# EAGLE schematic Arduelli (EAGLE 6.5.0)
Arduelli: Board that connects the ELL-i stack to the Arduino world (so that Arduino based shields work seamlessly with Ell-i)
CREVISION: 0.1; DESIGNER: Kameswar Rao Vaddina
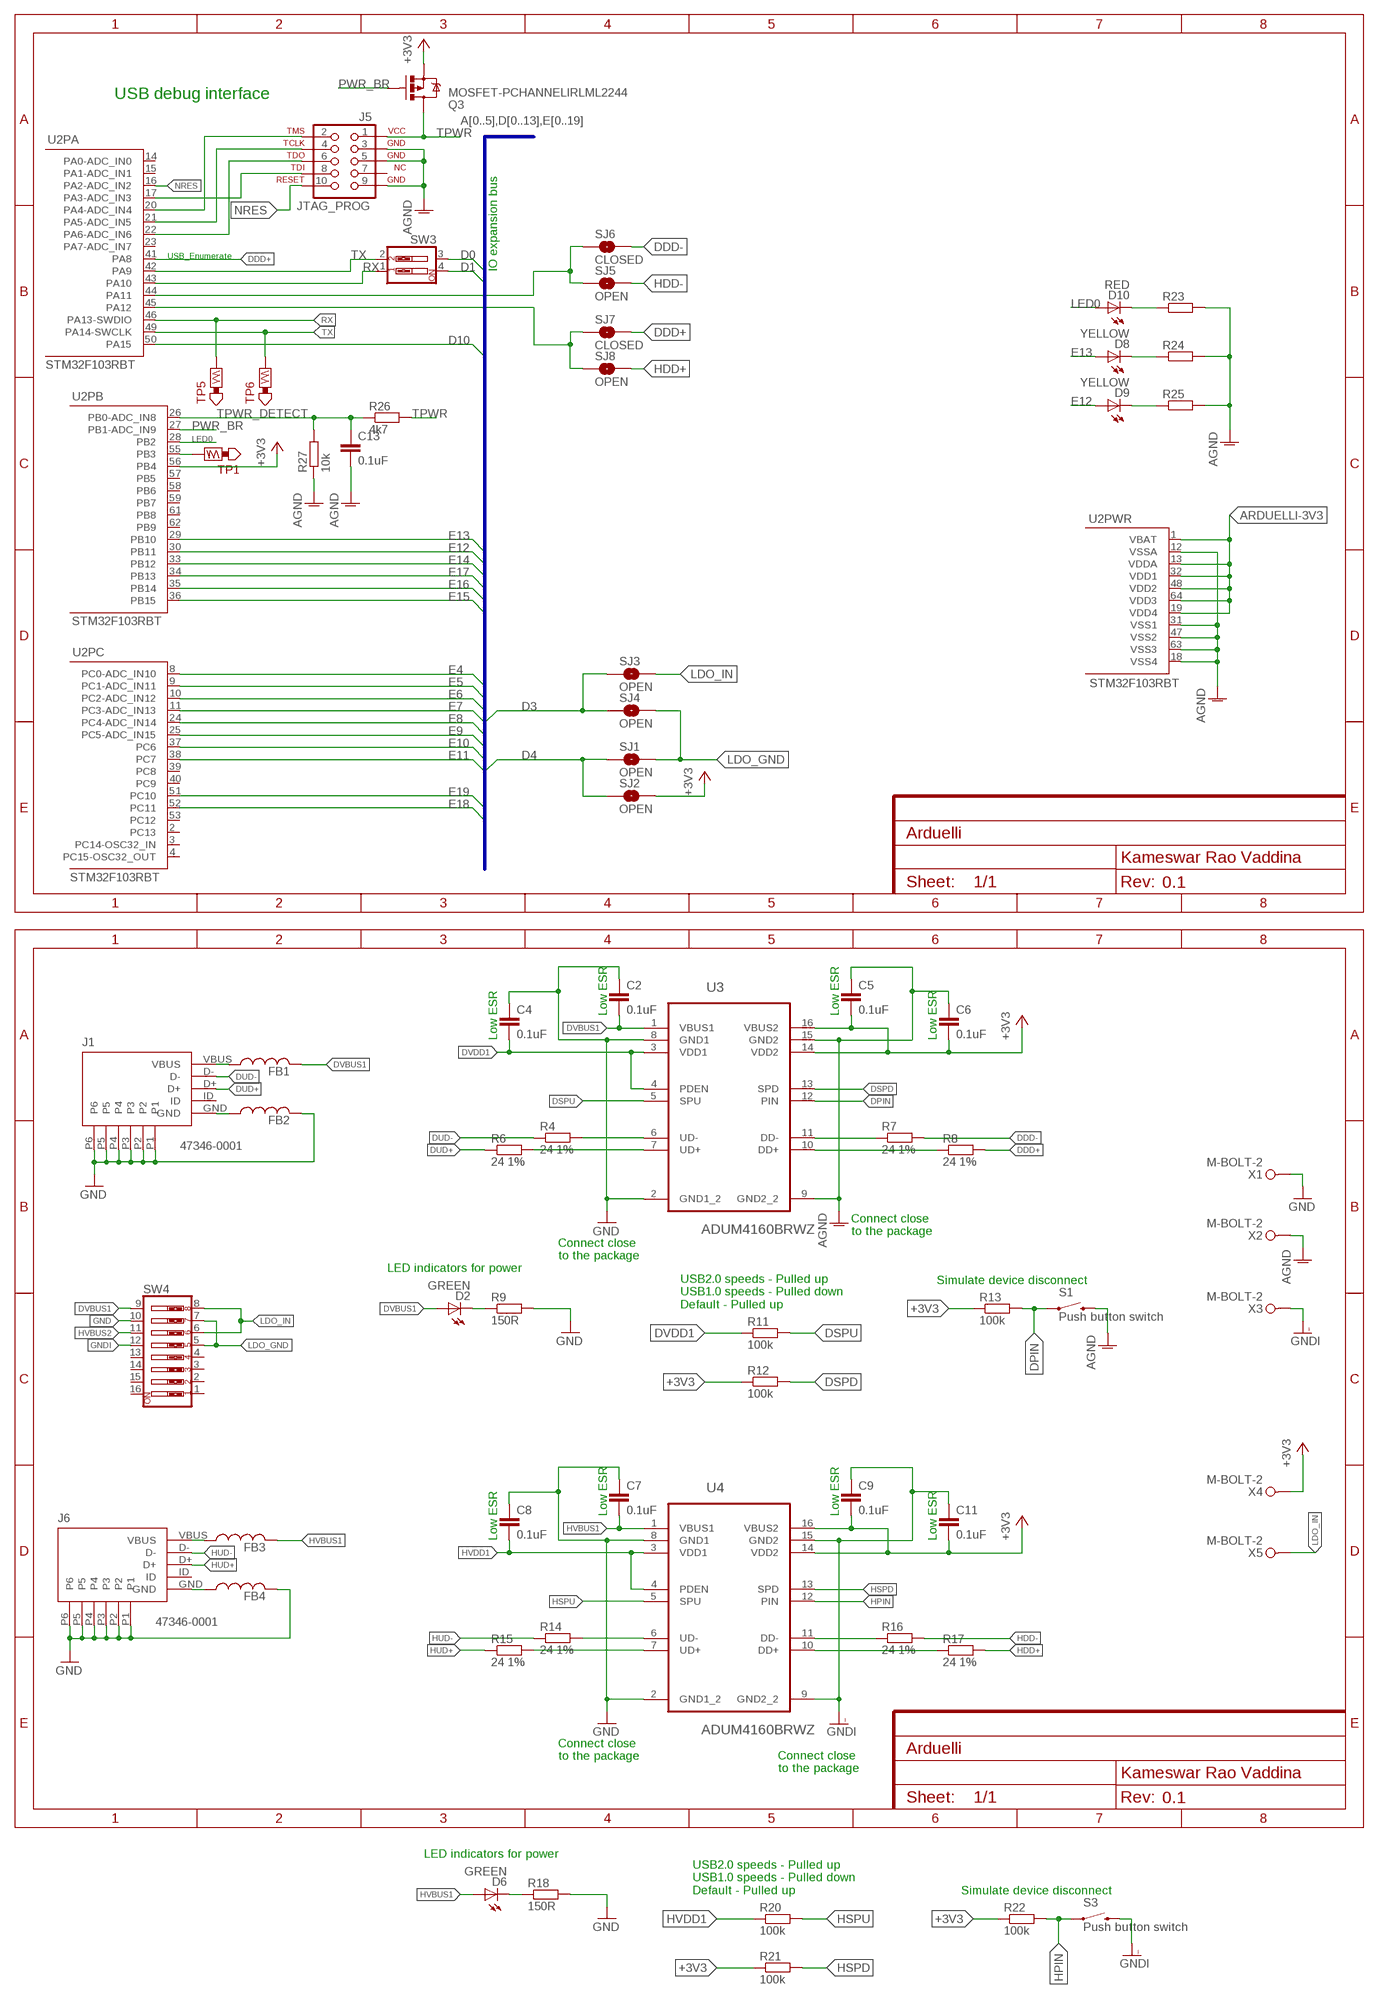
[diagram p0: schematic, sheet 1, part 1 of 2]
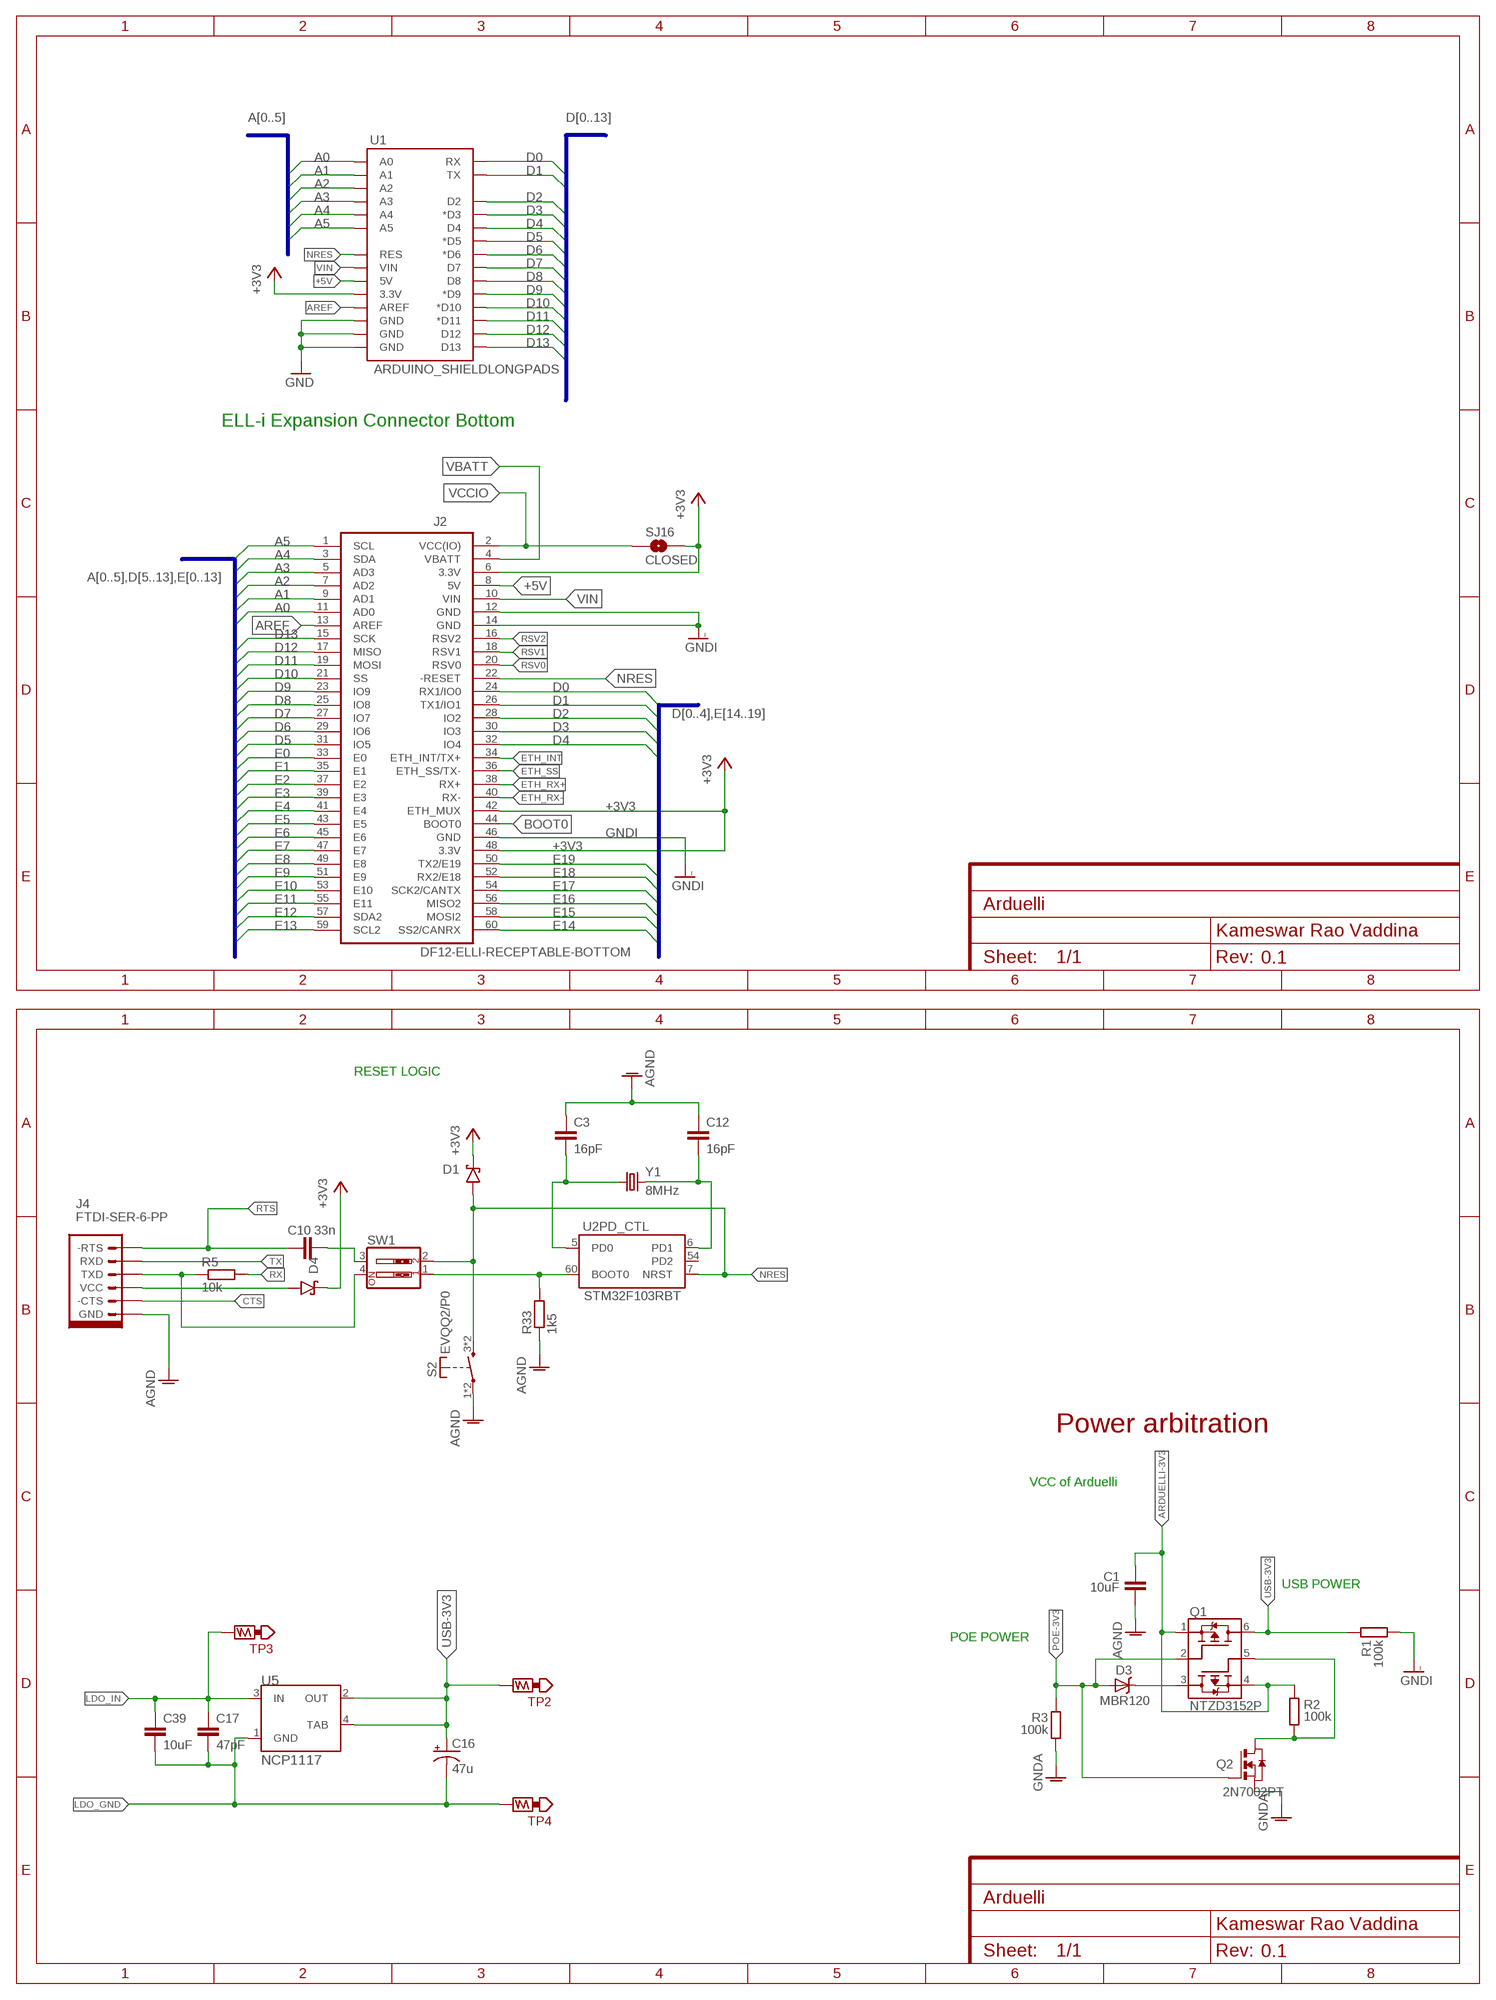
[diagram p1: schematic, sheet 1, part 2 of 2]

## Parts
C1  10uF  C0603  [C0603]
C2  0.1uF  C0402  [C0402]
C3  16pF  C0402  [C0402]
C4  0.1uF  C0402  [C0402]
C5  0.1uF  C0402  [C0402]
C6  0.1uF  C0402  [C0402]
C7  0.1uF  C0402  [C0402]
C8  0.1uF  C0402  [C0402]
C9  0.1uF  C0402  [C0402]
C10  33n  C0402  [C0402]
C11  0.1uF  C0402  [C0402]
C12  16pF  C0402  [C0402]
C13  0.1uF  C0402  [C0402]
C16  47u  CPOL6032  [CT6032]
C17  47pF  C0805  [C0805]
C39  10uF  C0805  [C0805]
D1  BAT60J  [SOD323_DIODE]
D2  GREEN  LED-GREEN0603  [LED-0603]
D3  MBR120  DIODE-SCHOTTKYB2100  [DIODE-B2100]
D4  BAT60J  [SOD323_DIODE]
D6  GREEN  LED-GREEN0603  [LED-0603]
D8  YELLOW  LED-YELLOW0603  [LED-0603]
D9  YELLOW  LED-YELLOW0603  [LED-0603]
D10  RED  LED-RED0603  [LED-0603]
FB1  FB1206  [FB1206]
FB2  FB1206  [FB1206]
FB3  FB1206  [FB1206]
FB4  FB1206  [FB1206]
J1  47346-0001  MICRO-USB  [MICRO_USB]
J2  DF12-ELLI-RECEPTABLE-BOTTOM  [DF12-60DS-0.5V]
J4  FTDI-SER-6-PP  [FTDI-SER-6-SIL]
J5  JTAG_PROG  [CLP-105-02-X-D]
J6  47346-0001  MICRO-USB  [MICRO_USB]
Q1  NTZD3152P  [SOT-563]
Q2  2N7002PT  [SOT-416]
Q3  MOSFET-PCHANNELIRLML2244  [SOT23-3]
R1  100k  R0402  [R0402]
R2  100k  R0402  [R0402]
R3  100k  R0402  [R0402]
R4  24 1%  R0402  [R0402]
R5  10k  R0402  [R0402]
R6  24 1%  R0402  [R0402]
R7  24 1%  R0402  [R0402]
R8  24 1%  R0402  [R0402]
R9  150R  R0402  [R0402]
R11  100k  R0402  [R0402]
R12  100k  R0402  [R0402]
R13  100k  R0402  [R0402]
R14  24 1%  R0402  [R0402]
R15  24 1%  R0402  [R0402]
R16  24 1%  R0402  [R0402]
R17  24 1%  R0402  [R0402]
R18  150R  R0402  [R0402]
R20  100k  R0402  [R0402]
R21  100k  R0402  [R0402]
R22  100k  R0402  [R0402]
R23  R0402  [R0402]
R24  R0402  [R0402]
R25  R0402  [R0402]
R26  4k7  R0402  [R0402]
R27  10k  R0402  [R0402]
R33  1k5  R0402  [R0402]
S1  Push button switch  SWITCH-MOMENTARY-2SMD  [TACTILE_SWITCH_SMD]
S2  EVQQ2/P0  [EVQQ2/P0]
S3  Push button switch  SWITCH-MOMENTARY-2SMD  [TACTILE_SWITCH_SMD]
SJ1  OPEN  SOLDERJUMPERNO  [SJ_2S-NO]
SJ2  OPEN  SOLDERJUMPERNO  [SJ_2S-NO]
SJ3  OPEN  SOLDERJUMPERNO  [SJ_2S-NO]
SJ4  OPEN  SOLDERJUMPERNO  [SJ_2S-NO]
SJ5  OPEN  SOLDERJUMPERNO  [SJ_2S-NO]
SJ6  CLOSED  SOLDERJUMPERNO  [SJ_2S-NO]
SJ7  CLOSED  SOLDERJUMPERNO  [SJ_2S-NO]
SJ8  OPEN  SOLDERJUMPERNO  [SJ_2S-NO]
SJ16  CLOSED  SOLDERJUMPERTRACE  [SJ_2S-TRACE]
SW1  SW_DIP-2-SMT-HALFSIZE  [DIPSWITCH-02-50MIL]
SW3  SW_DIP-2-SMT-HALFSIZE  [DIPSWITCH-02-50MIL]
SW4  SW_DIP-8-SMT-HALFSIZE  [DIPSWITCH-08-50MIL]
TP1  TEST_POINT-5000  [TP_5021]
TP2  TEST_POINT-5021  [TP_5000]
TP3  TEST_POINT-5021  [TP_5000]
TP4  TEST_POINT-5021  [TP_5000]
TP5  TEST_POINT-5000  [TP_5021]
TP6  TEST_POINT-5000  [TP_5021]
U1  ARDUINO_SHIELDLONGPADS  [DUEMILANOVE_SHIELD_LONGPADS]
U2  STM32F103RBT  [LQFP64]
U3  ADUM4160BRWZ  [SOIC127P1032X265-16N]
U4  ADUM4160BRWZ  [SOIC127P1032X265-16N]
U5  NCP1117  [SOT223]
X1  M-BOLT-2  [M2-1]
X2  M-BOLT-2  [M2-1]
X3  M-BOLT-2  [M2-1]
X4  M-BOLT-2  [M2-1]
X5  M-BOLT-2  [M2-1]
Y1  8MHz  CRYSTALTXC-7A  [CRYSTAL-TXC-7A]

## Nets
+3V3 [power]: C5.2 C6.2 C9.2 C11.2 D1.1(C) D4.1(C) J2.6(3.3V) J2.42(ETH_MUX) J2.48(3.3V) Q3.2(S) R12.1 R13.1 R21.1 R22.1 SJ2.2 SJ16.2 U1.3.3V U2.56(PB:PB4) U3.14(VDD2) U3.16(VBUS2) U4.14(VDD2) U4.16(VBUS2) X4.1(KL1)
+5V [power]: J2.8(5V) U1.5V
-RTS: C10.2 SW1.3
A0: J2.11(AD0) U1.A0
A1: J2.9(AD1) U1.A1
A2: J2.7(AD2) U1.A2
A3: J2.5(AD3) U1.A3
A4: J2.3(SDA) U1.A4
A5: J2.1(SCL) U1.A5
AGND: C1.2 C3.1 C5.1 C6.1 C12.1 C13.2 J4.GND J5.3 J5.5 J5.9 R23.2 R24.2 R25.2 R27.1 R33.1 S1.3 S2.1(P) S2.2(P) U2.12(PWR:VSSA) U2.18(PWR:VSS4) U2.31(PWR:VSS1) U2.47(PWR:VSS2) U2.63(PWR:VSS3) U3.9(GND2_2) U3.15(GND2) X2.1(KL1)
ARDUELLI-3V3 [power]: C1.1 Q1.1(S1) Q1.4(S2) R2.2 U2.1(PWR:VBAT) U2.13(PWR:VDDA) U2.19(PWR:VDD4) U2.32(PWR:VDD1) U2.48(PWR:VDD2) U2.64(PWR:VDD3)
AREF: J2.13(AREF) U1.AREF
BOOT0: J2.44(BOOT0) R33.2 SW1.1 U2.60(PD_CTL:BOOT0)
BOOT0TX: J4.TXD R5.1 SW1.4
CTS: J4.-CTS
D0: J2.24(RX1/IO0) SW3.3 U1.RX
D1: J2.26(TX1/IO1) SW3.4 U1.TX
D2: J2.28(IO2) U1.D2
D3: J2.30(IO3) SJ3.1 SJ4.1 U1.D3(*D3)
D4: J2.32(IO4) SJ1.1 SJ2.1 U1.D4
D5: J2.31(IO5) U1.D5(*D5)
D6: J2.29(IO6) U1.D6(*D6)
D7: J2.27(IO7) U1.D7
D8: J2.25(IO8) U1.D8
D9: J2.23(IO9) U1.D9(*D9)
D10: J2.21(SS) U1.D10(*D10) U2.50(PA:PA15)
D11: J2.19(MOSI) U1.D11(*D11)
D12: J2.17(MISO) U1.D12
D13: J2.15(SCK) U1.D13
DDD+: R8.2 SJ7.1 SJ7.2 SJ8.1 U2.41(PA:PA8) U2.45(PA:PA12)
DDD-: R7.2 SJ5.1 SJ6.1 SJ6.2 U2.44(PA:PA11)
DPIN: R13.2 S1.1 U3.12(PIN)
DSPD: R12.2 U3.13(SPD)
DSPU: R11.2 U3.5(SPU)
DUD+: J1.D+ R6.1
DUD-: J1.D- R4.1
DVBUS1: C2.2 D2.A FB1.1 SW4.9 U3.1(VBUS1)
DVDD1: C4.2 R11.1 U3.3(VDD1) U3.4(PDEN)
E0: J2.33(E0)
E1: J2.35(E1)
E2: J2.37(E2)
E3: J2.39(E3)
E4: J2.41(E4) U2.8(PC:PC0-ADC_IN10)
E5: J2.43(E5) U2.9(PC:PC1-ADC_IN11)
E6: J2.45(E6) U2.10(PC:PC2-ADC_IN12)
E7: J2.47(E7) U2.11(PC:PC3-ADC_IN13)
E8: J2.49(E8) U2.24(PC:PC4-ADC_IN14)
E9: J2.51(E9) U2.25(PC:PC5-ADC_IN15)
E10: J2.53(E10) U2.37(PC:PC6)
E11: J2.55(E11) U2.38(PC:PC7)
E12: D9.A J2.57(SDA2) U2.30(PB:PB11)
E13: D8.A J2.59(SCL2) U2.29(PB:PB10)
E14: J2.60(SS2/CANRX) U2.33(PB:PB12)
E15: J2.58(MOSI2) U2.36(PB:PB15)
E16: J2.56(MISO2) U2.35(PB:PB14)
E17: J2.54(SCK2/CANTX) U2.34(PB:PB13)
E18: J2.52(RX2/E18) U2.52(PC:PC11)
E19: J2.50(TX2/E19) U2.51(PC:PC10)
ETH_INT: J2.34(ETH_INT/TX+)
ETH_RX+: J2.38(RX+)
ETH_RX-: J2.40(RX-)
ETH_SS: J2.36(ETH_SS/TX-)
GND: C2.1 C4.1 C7.1 C8.1 FB2.1 FB4.1 J1.P1 J1.P2 J1.P3 J1.P4 J1.P5 J1.P6 J6.P1 J6.P2 J6.P3 J6.P4 J6.P5 J6.P6 R9.2 R18.2 SW4.10 U1.GND@0(GND) U1.GND@1(GND) U1.GND@2(GND) U3.2(GND1_2) U3.8(GND1) U4.2(GND1_2) U4.8(GND1) X1.1(KL1)
GNDA: Q2.3(S) R3.1
GNDI [power]: C9.1 C11.1 J2.12(GND) J2.14(GND) J2.46(GND) R1.1 S3.3 SW4.12 U4.9(GND2_2) U4.15(GND2) X3.1(KL1)
HDD+: R17.2 SJ8.2
HDD-: R16.2 SJ5.2
HPIN: R22.2 S3.1 U4.12(PIN)
HSPD: R21.2 U4.13(SPD)
HSPU: R20.2 U4.5(SPU)
HUD+: J6.D+ R15.1
HUD-: J6.D- R14.1
HVBUS1: C7.2 D6.A FB3.1 U4.1(VBUS1)
HVBUS2: SW4.11
HVDD1: C8.2 R20.1 U4.3(VDD1) U4.4(PDEN)
LDO_GND: C16.P$2(-) C17.2 C39.2 SJ1.2 SJ4.2 SW4.5 SW4.7 TP4.P$1 U5.1(GND)
LDO_IN: C17.1 C39.1 SJ3.2 SW4.6 SW4.8 TP3.P$1 U5.3(IN) X5.1(KL1)
LED0: D10.A U2.28(PB:PB2)
N$1: FB1.2 J1.VBUS
N$2: D3.C Q1.3(D2)
N$3: FB2.2 J1.GND
N$4: D6.C R18.1
N$6: R4.2 U3.6(UD-)
N$7: R6.2 U3.7(UD+)
N$8: Q1.5(G2) Q2.1(D) R2.1
N$9: C3.2 U2.5(PD_CTL:PD0) Y1.P$1
N$10: C12.2 U2.6(PD_CTL:PD1) Y1.P$2
N$11: D2.C R9.1
N$13: D10.C R23.1
N$14: D8.C R24.1
N$15: TP1.P$1 U2.55(PB:PB3)
N$16: R7.1 U3.11(DD-)
N$17: R8.1 U3.10(DD+)
N$24: FB3.2 J6.VBUS
N$25: FB4.2 J6.GND
N$26: R14.2 U4.6(UD-)
N$27: R15.2 U4.7(UD+)
N$28: R16.1 U4.11(DD-)
N$29: R17.1 U4.10(DD+)
N$30: D9.C R25.1
NRES: D1.2(A) J2.22(-RESET) J5.10 S2.3(S) S2.4(S) SW1.2 U1.RES U2.7(PD_CTL:NRST) U2.16(PA:PA2-ADC_IN2)
POE-3V3 [power]: D3.A Q1.2(G1) Q2.2(G) R3.2
PWR_BR: Q3.1(G) U2.27(PB:PB1-ADC_IN9)
RSV0: J2.20(RSV0)
RSV1: J2.18(RSV1)
RSV2: J2.16(RSV2)
RTS: C10.1 J4.-RTS
RX: R5.2 SW3.1 TP5.P$1 U2.43(PA:PA10) U2.46(PA:PA13-SWDIO)
TCLK: J5.4 U2.21(PA:PA5-ADC_IN5)
TDI: J5.8 U2.17(PA:PA3-ADC_IN3)
TDO: J5.6 U2.22(PA:PA6-ADC_IN6)
TMS: J5.2 U2.20(PA:PA4-ADC_IN4)
TPWR [power]: J5.1 Q3.3(D) R26.2
TPWR_DETECT: C13.1 R26.1 R27.2 U2.26(PB:PB0-ADC_IN8)
TX: J4.RXD SW3.2 TP6.P$1 U2.42(PA:PA9) U2.49(PA:PA14-SWCLK)
USB-3V3 [power]: C16.P$1(+) Q1.6(D1) R1.2 TP2.P$1 U5.2(OUT) U5.4(TAB)
VBATT: J2.4(VBATT)
VCC-IN: D4.2(A) J4.VCC
VCCIO: J2.2(VCC(IO)) SJ16.1
VIN: J2.10(VIN) U1.VIN
Unconnected: J1.ID J5.7 J6.ID SW4.1 SW4.2 SW4.3 SW4.4 SW4.13 SW4.14 SW4.15 SW4.16 U2.2(PC:PC13) U2.3(PC:PC14-OSC32_IN) U2.4(PC:PC15-OSC32_OUT) U2.14(PA:PA0-ADC_IN0) U2.15(PA:PA1-ADC_IN1) U2.23(PA:PA7-ADC_IN7) U2.39(PC:PC8) U2.40(PC:PC9) U2.53(PC:PC12) U2.54(PD_CTL:PD2) U2.57(PB:PB5) U2.58(PB:PB6) U2.59(PB:PB7) U2.61(PB:PB8) U2.62(PB:PB9)

## Buses
D[0..13]
A[0..5],D[0..13],E[0..19]
A[0..5],D[5..13],E[0..13]
D[0..4],E[14..19]
A[0..5]

## Notes on the sheet
- USB debug interface
- USB_Enumerate
- IO expansion bus
- ELL-i Expansion Connector Bottom
- RESET LOGIC
- Low ESR | Low ESR
- Low ESR | Low ESR
- Connect close 
  to the package
- Connect close 
  to the package
- LED indicators for power
- Simulate device disconnect
- USB2.0 speeds - Pulled up
  USB1.0 speeds - Pulled down
  Default - Pulled up
- Power arbitration
- VCC of Arduelli
- USB POWER
- POE POWER
- Low ESR | Low ESR
- Low ESR | Low ESR
- Connect close 
  to the package
- Connect close 
  to the package
- LED indicators for power
- USB2.0 speeds - Pulled up
  USB1.0 speeds - Pulled down
  Default - Pulled up
- Simulate device disconnect

## Library data of the parts
C1-C13 C17 C39 = ELL-i-Passives:C: Surface Mount Capasitors — in standard sizes A capacitor used to store energy electrostatically in an electric field. If you need a high-value capacitor, consider using a polarised capacitor to save space. Wikipedia article on capacitors <https://en.wikipedia.org/wiki/Capacitor>
C16 = ELL-i-Passives:CPOL: Polarized Capacitor — common SMD and some through-hole ones A capacitor used to store energy electrostatically in an electric field. If you need a high-value capacitor, consider using a polarised capacitor to save space. Wikipedia article on capacitors <https://en.wikipedia.org/wiki/Capacitor> These are standard surface mount (SMD) and through-hole (PTH) capacitors. Normally 10uF, 47uF, and 100uF in electrolytic and tantalum varieties. Always verify the external diameter of the through hole cap, it varies with capacity, voltage, and manufacturer. The EIA tantalum devices should have standard packages. Copied from SparkFun-Passives.lbr under SparkFun Creative Commons license. Adopted to EagleUp usage through renaming the packages appropriately.
D1 D4 = ell-i:BAT60J
D2 D6 = SparkFun-LED:LED-GREEN: Various green LEDs Green LEDs used in SFE Production 0603- DIO-00821 LARGE- DIO-00862 LILYPAD- DIO-09910; PROD_ID: DIO-00821
D3 = ELL-i-DiscreteSemi:DIODE-SCHOTTKY: Schottky Diodes A Schottky diode has a low forward voltage drop and a very fast switching action. A normal silicon diode has a voltage drop between 0.6–0.7 volts, while a Schottky diode voltage drop is between approximately 0.15–0.45 volts. This lower voltage drop can provide higher switching speed and better system efficiency. Wikipedia article on Schottky diodes <https://en.wikipedia.org/wiki/Schottky_diode>
D8 D9 = SparkFun-LED:LED-YELLOW: Yellow SMD LEDs LilyPad 1206- DIO-09909 0603- DIO-09003; PROD_ID: DIO-09003
D10 = SparkFun-LED:LED-RED: Assorted Red LEDs LilyPad 1206- DIO-09912 1206- DIO-00809 0603- DIO-00819; PROD_ID: DIO-00819
FB1-FB4 = ELL-i-Passives:FB: Ferrite beads Ferrite beads are choke coils used to suppress high frequency noise in electronic circuits. Wikipedia article on ferrite beads <https://en.wikipedia.org/wiki/Ferrite_bead>
J1 J6 = ELL-i-Connectors:MICRO-USB: Micro USB from Molex CONN RCPT 5POS MICRO USB R/A Datasheet <http://www.molex.com/pdm_docs/sd/473460001_sd.pdf>; PARTNO: AS-ITM-00021
J2 = ELL-i-Connectors:DF12-ELLI-*
J4 = ELL-i-Connectors:FTDI-SER-6: FTDI cable connector In several package variant, including pogopin version.
J5 = ELL-i-Connectors:JTAG_PROG: JTAG 10-pin ICSP Header This is an ARM / Keil compatible 10-pin 1.27 mm pitch In Circuit Serial Programming (ICSP) JTAG header. Keil Connectors <http://www.keil.com/support/man/docs/ulink2/ulink2_hw_connectors.htm>
Q1 = ELL-i-DiscreteSemi:NTZD3152P: OnSemi dual P-channel Small Signal MOSFET 20V 430mA Datasheet <http://www.onsemi.com/pub_link/Collateral/NTZD3152P-D.PDF> (from onsemi)
Q2 = ELL-i-DiscreteSemi:2N7002PT: MOSFET N-CH SGL 60V SOT-416 N-channel enhancement mode Field-Effect Transistor (FET) in a small SOT416 (SC-75) Surface-Mounted Device (SMD) plastic package using Trench MOSFET technology Datasheet <http://www.nxp.com/documents/data_sheet/2N7002PT.pdf>
Q3 = SparkFun-DiscreteSemi:MOSFET-PCHANNEL: Generic PMOSFET; PROD_ID: TRANS-11153
R1-R9 R11-R18 R20-R27 R33 = ELL-i-Passives:R: Surface Mount Resistor — in standard sizes
S1 S3 = SparkFun-Electromechanical:SWITCH-MOMENTARY-2: Various NO switches- pushbuttons, reed, etc; PROD_ID: SWCH-08247
S2 = ell-i:EVQQ2/P0
SJ1-SJ8 SJ16 = SparkFun-Passives:SOLDERJUMPER: Solder Jumper Standard SMD solder jumper. Used to automate production. Two varients : Normally Open and Normally Closed are the same, but have different paste layers. NC will have a large amount of paste and should jumper during reflow.
SW1 SW3 = SparkFun-Electromechanical:SW_DIP-2: DIP SWITCH
SW4 = SparkFun-Electromechanical:SW_DIP-8: DIP Switch 8 Position
TP1-TP6 = ELL-i-Passives:TEST_POINT: Used for easier attachment of measuring equipment. Has both test loops and bare copper area.
U1 = SparkFun-Boards:ARDUINO_SHIELD: Arduino shield footprint
U2 = ELL-i-DigitalIC:STM32F103R: STM32F103 Medium Density 64pin LQFP Datasheet <http://www.st.com/st-web-ui/static/active/en/resource/technical/document/datasheet/CD00161566.pdf>; FLASH: 128K
U3 U4 = ELL-i-PowerIC:ADUM4160BRWZ: ADuM4160 USB isolator: Full/Low Speed 5 kV USB Digital Isolator Datasheet <http://www.analog.com/static/imported-files/data_sheets/ADuM4160.pdf>; MPN: ADUM4160BRWZ; OC_FARNELL: 1858056; OC_NEWARK: 24R8652; PACKAGE: SOIC-16; SUPPLIER: Analog Devices
U5 = ell-i:NCP1117
X1-X5 = ELL-i-Connectors:M-BOLT: Metric bolt connector
Y1 = SparkFun-FreqCtrl:CRYSTAL: Various standard crystals. Proven footprints. Spark Fun Electronics SKU : COM-00534

## Net classes
1 power: width 0.3 mm, drill 0.3 mm, clearance 0.15 mm